# EAGLE design Keypad 0.0 (EAGLE 7.7.0)
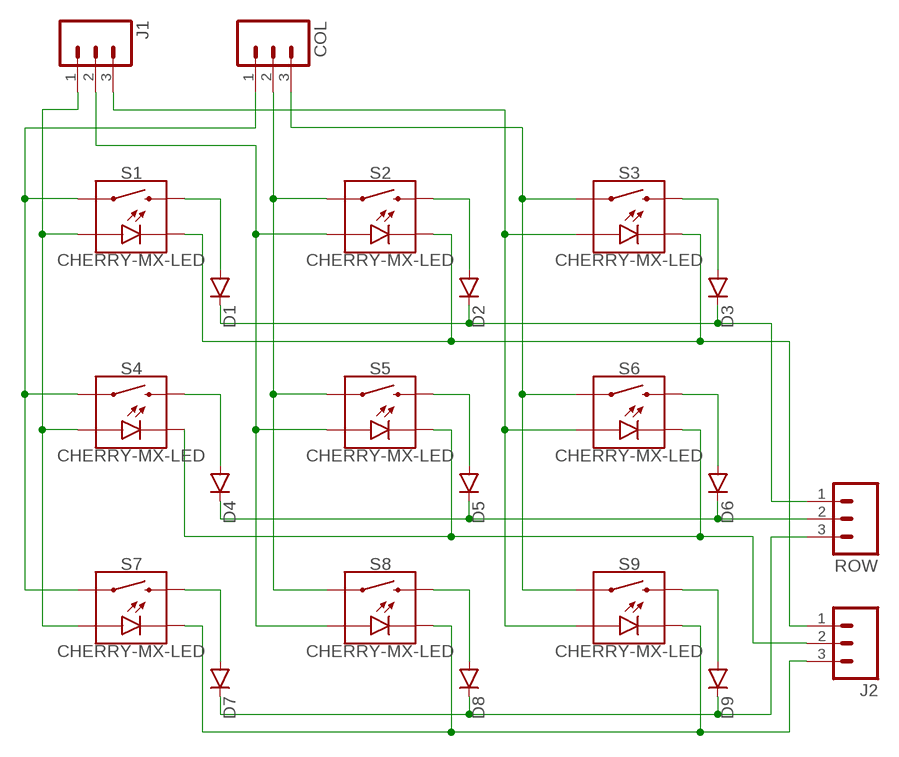
[diagram p0: schematic, sheet 1]

## Parts
COL  M03LOCK  [1X03_LOCK]
D1  DIODESOT23  [SOT23-3]
D2  DIODESOT23  [SOT23-3]
D3  DIODESOT23  [SOT23-3]
D4  DIODESOT23  [SOT23-3]
D5  DIODESOT23  [SOT23-3]
D6  DIODESOT23  [SOT23-3]
D7  DIODESOT23  [SOT23-3]
D8  DIODESOT23  [SOT23-3]
D9  DIODESOT23  [SOT23-3]
J1  M03LOCK  [1X03_LOCK]
J2  M03LOCK  [1X03_LOCK]
ROW  M03LOCK  [1X03_LOCK]
S1  CHERRY-MX-LED  [CHERRY-MX-LED]
S2  CHERRY-MX-LED  [CHERRY-MX-LED]
S3  CHERRY-MX-LED  [CHERRY-MX-LED]
S4  CHERRY-MX-LED  [CHERRY-MX-LED]
S5  CHERRY-MX-LED  [CHERRY-MX-LED]
S6  CHERRY-MX-LED  [CHERRY-MX-LED]
S7  CHERRY-MX-LED  [CHERRY-MX-LED]
S8  CHERRY-MX-LED  [CHERRY-MX-LED]
S9  CHERRY-MX-LED  [CHERRY-MX-LED]

## Nets
N$1: COL.1 S1.S1 S4.S1 S7.S1
N$2: COL.2 S2.S1 S5.S1 S8.S1
N$3: COL.3 S3.S1 S6.S1 S9.S1
N$4: D1.3(C) D2.3(C) D3.3(C) ROW.1
N$5: D4.3(C) D5.3(C) D6.3(C) ROW.2
N$6: D7.3(C) D8.3(C) D9.3(C) ROW.3
N$7: D1.1(A) S1.S2
N$8: D2.1(A) S2.S2
N$9: D3.1(A) S3.S2
N$10: D4.1(A) S4.S2
N$11: D5.1(A) S5.S2
N$12: D6.1(A) S6.S2
N$13: D7.1(A) S7.S2
N$14: D8.1(A) S8.S2
N$15: D9.1(A) S9.S2
N$16: J1.1 S1.A S4.A S7.A
N$17: J1.2 S2.A S5.A S8.A
N$18: J1.3 S3.A S6.A S9.A
N$19: J2.1 S1.K(C) S2.K(C) S3.K(C)
N$20: J2.2 S4.K(C) S5.K(C) S6.K(C)
N$21: J2.3 S7.K(C) S8.K(C) S9.K(C)

## Library data of the parts
COL J1 J2 ROW = SparkFun-Connectors:M03: Header 3 Standard 3-pin 0.1" header. Use with straight break away headers (SKU : PRT-00116), right angle break away headers (PRT-00553), swiss pins (PRT-00743), machine pins (PRT-00117), and female headers (PRT-00115). Molex polarized connector foot print use with SKU : PRT-08232 with associated crimp pins and housings.
D1-D9 = SparkFun-DiscreteSemi:DIODE: Diode These are standard reverse protection diodes and small signal diodes. SMA package can handle up to about 1A. SOD-323 can handle about 200mA. What the SOD-323 package when ordering, there are some mfgs out there that are 5-pin packages.
S1-S9 = SparkFun-Electromechanical:CHERRY-MX-LED: Cherry MX Switch - Electromechanical Swith w/ LED Cherry MX Keyswitches are top-of-the-line mechanical keyboard switches. They’re satisfyingly “clicky”, reliable up to tens-of-millions of key presses, and a standard in gaming and programming keyboards across the globe. This ‘blue’ version Cherry MX Switch is favored by most due to its secondary internal actuator making it less likely to “double-tap.” If you are looking for a noticeably audible and high-quality key switch, this is the perfect option for you! SparkFun Product Link <https://www.sparkfun.com/products/13834>; SF_ID: COM-13834

## Board
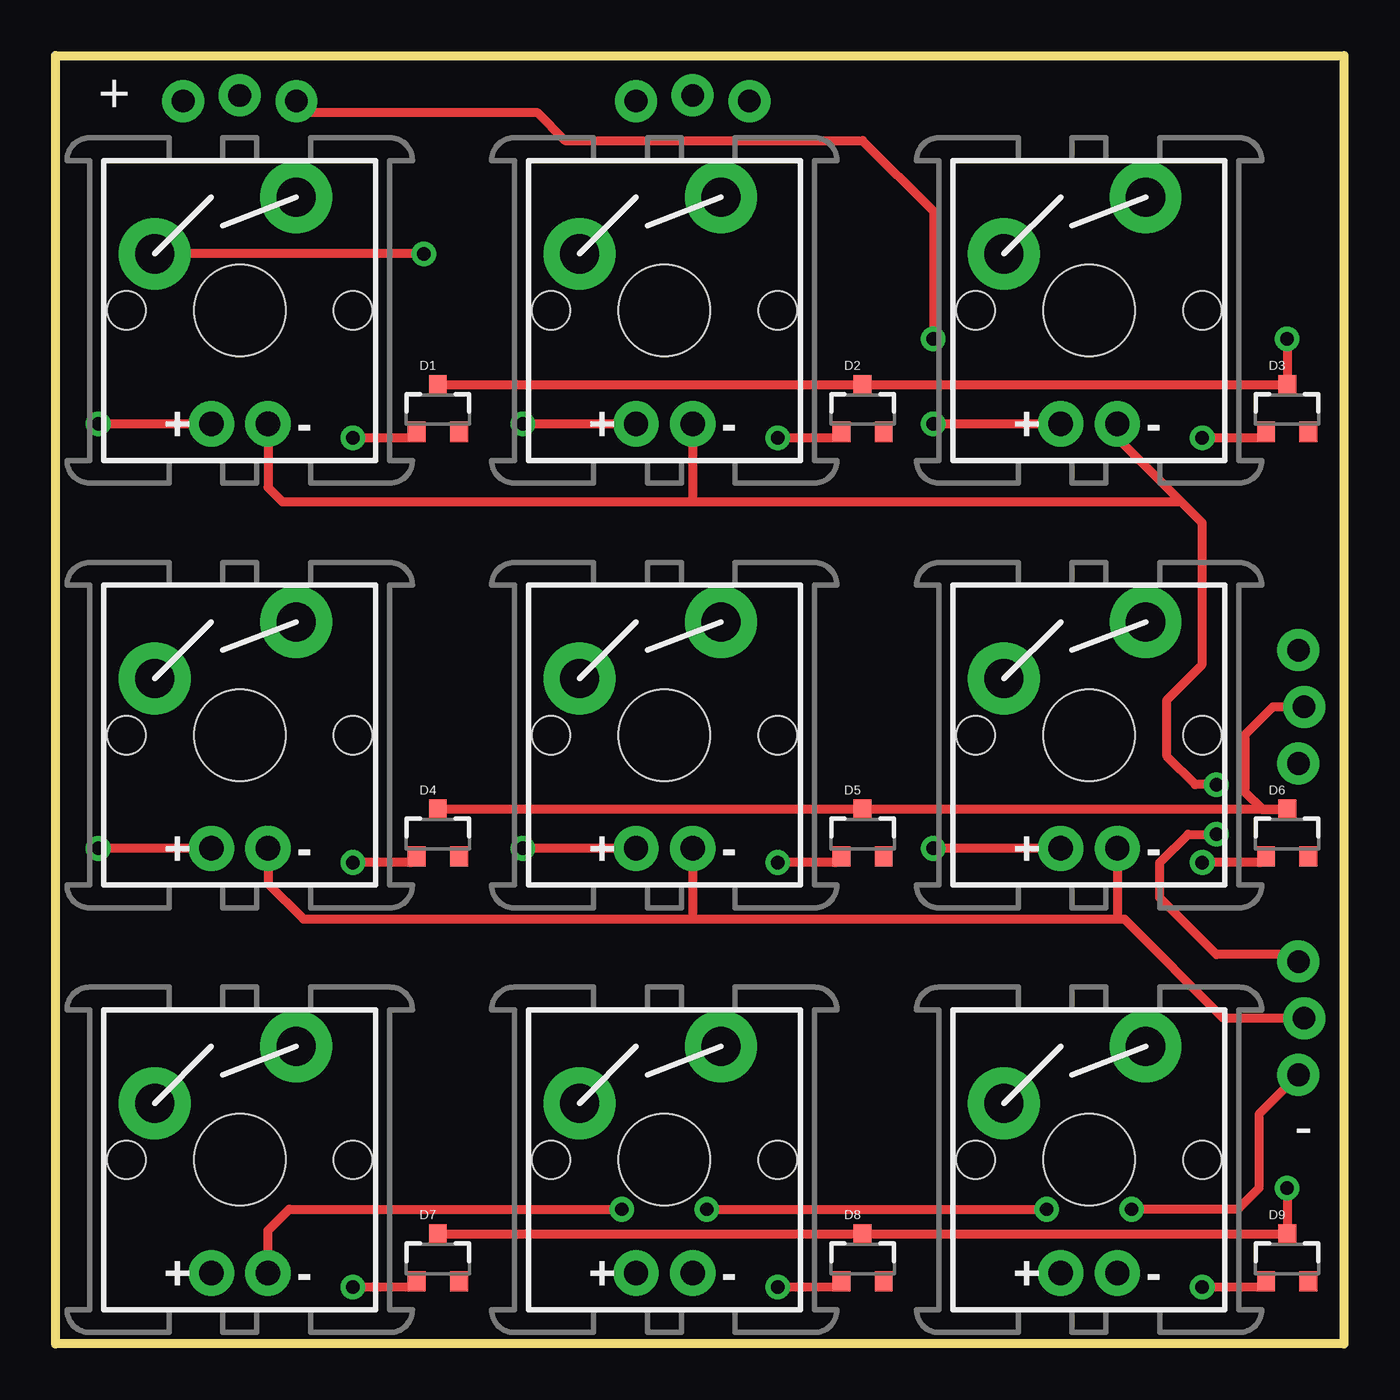
[diagram p1: board, top side]
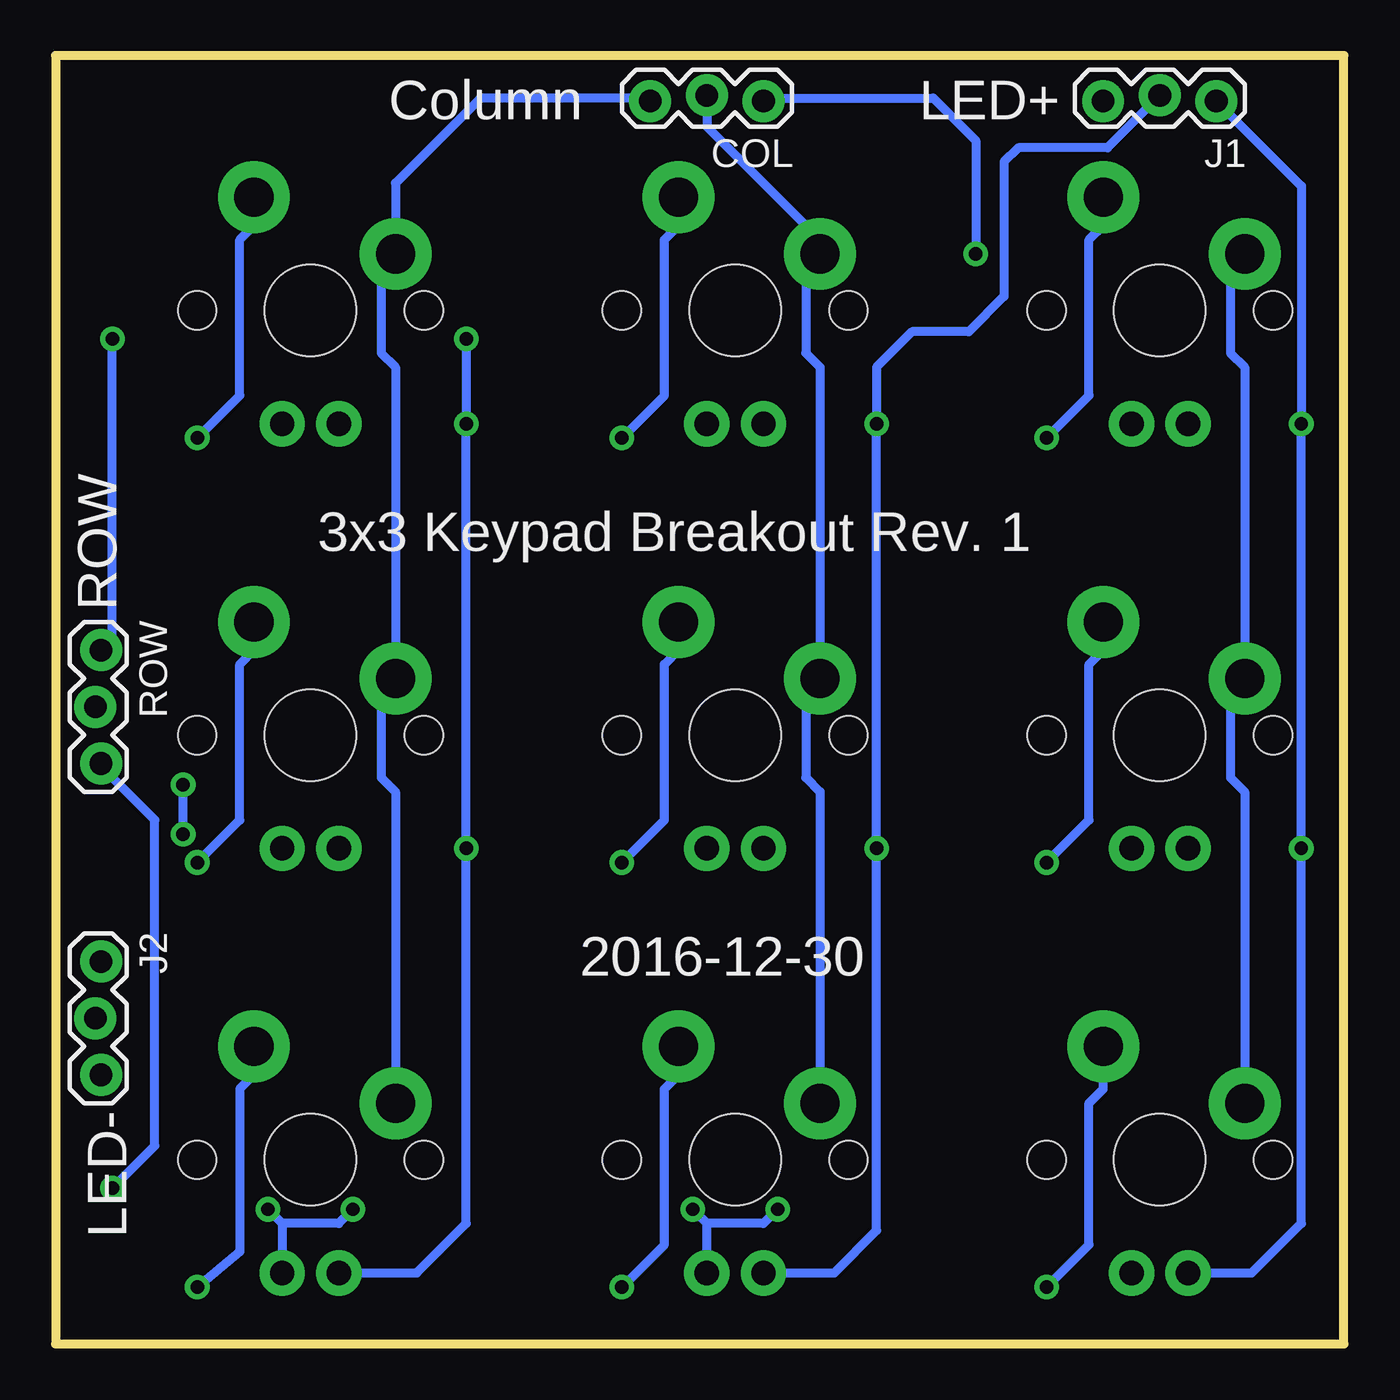
[diagram p2: board, bottom side, seen from below]

Size 57.78 x 57.78 mm. Coordinates in mm from the lower left corner, seen from the top.
Outline: 0,0 0,57.78 57.78,57.78 57.78,0 0,0
Copper layers (1*16): Top 0.035mm / dielectric 1.5mm / Bottom 0.035mm
Design rules "SparkFun": minimum track width 8mil, minimum drill 20mil, track to track 8mil, track to pad 8mil, pad to pad 8mil, via to via 8mil, smd to smd 8mil, copper to edge 8mil, drill to drill 8mil, minimum pad ring 12mil, minimum via ring 10mil, stop-mask expansion 4mil, vias tented up to drill 20mil, thermal gap 10mil

### Footprints (pad centres in the part's own frame; a part is rotated, then mirrored left to right if it is on the bottom)
1X03_LOCK = drill 1.016 pad 1.88: 1 0,0.127; 2 2.54,-0.127; 3 5.08,0.127
SOT23-3 = smd 0.8 x 0.9: 1 -0.95,-1; 2 0.95,-1; 3 0,1.1
CHERRY-MX-LED = drill 1.092 pad 2.032: A -1.27,-5.08; K 1.27,-5.08 | drill 1.753 pad 3.226: S1 -3.81,2.54; S2 2.54,5.08 | hole 4.089: 0,0 | hole 1.707: -5.08,0; 5.08,0

### Placement (x,y rotation side)
COL  26.04,55.88 180 bottom
D1  17.14,41.91 0 top
D2  36.2,41.91 0 top
D3  55.24,41.91 0 top
D4  17.14,22.86 0 top
D5  36.2,22.86 0 top
D6  55.24,22.86 0 top
D7  17.14,3.81 0 top
D8  36.2,3.81 0 top
D9  55.24,3.81 0 top
J1  5.71,55.88 180 bottom
J2  55.88,17.14 270 bottom
ROW  55.88,31.11 270 bottom
S1  8.26,46.35 0 top
S2  27.3,46.35 0 top
S3  46.35,46.35 0 top
S4  8.26,27.3 0 top
S5  27.3,27.3 0 top
S6  46.35,27.3 0 top
S7  8.26,8.26 0 top
S8  27.3,8.26 0 top
S9  46.35,8.26 0 top

### Tracks (layer width: path | path; a pad name or v marks a point on that pad's centre or on a via)
N$1  (via drill 0.6)
  Top 0.406: v16.51,48.9 S1.S1
  Bottom 0.406: S1.S1 5.08,48.26 5.08,44.45 4.45,43.81 S4.S1 5.08,29.21 5.08,25.4 4.45,24.77 S7.S1 | COL.1 25.91,55.88 18.41,55.88 16.51,53.98 v16.51,48.9
N$2
  Bottom 0.406: COL.2 28.57,54.61 23.5,49.53 S2.S1 24.13,48.26 24.13,44.45 23.5,43.81 S5.S1 24.13,29.21 24.13,25.4 23.5,24.77 S8.S1
N$3
  Bottom 0.406: COL.3 31.24,55.88 38.73,55.88 42.55,52.07 S3.S1 43.18,48.26 43.18,44.45 42.55,43.81 S6.S1 43.18,29.21 43.18,25.4 42.55,24.77 S9.S1
N$4  (via drill 0.6)
  Top 0.406: v55.24,45.09 D3.3 D2.3 D1.3
  Bottom 0.406: ROW.1 55.24,31.62 v55.24,45.09
N$5
  Top 0.406: ROW.2 54.61,28.57 53.34,27.3 53.34,24.77 54.15,23.96 D6.3 D5.3 D4.3
N$6  (via drill 0.6)
  Top 0.406: v55.24,6.99 D9.3 D8.3 D7.3
  Bottom 0.406: ROW.3 55.24,25.53 55.24,25.4 53.34,23.5 53.34,8.89 v55.24,6.99
N$7  (via drill 0.6)
  Top 0.406: D1.1 15.93,40.64 v13.34,40.64
  Bottom 0.406: v13.34,40.64 11.43,42.55 11.43,49.53 10.79,50.16 S1.S2
N$8  (via drill 0.6)
  Top 0.406: D2.1 34.98,40.64 v32.38,40.64
  Bottom 0.406: v32.38,40.64 30.48,42.55 30.48,49.53 29.84,50.16 S2.S2
N$9  (via drill 0.6)
  Top 0.406: D3.1 54.02,40.64 v51.44,40.64
  Bottom 0.406: v51.44,40.64 49.53,42.55 49.53,49.53 48.9,50.16 S3.S2
N$10  (via drill 0.6)
  Top 0.406: D4.1 15.93,21.59 v13.34,21.59
  Bottom 0.406: v13.34,21.59 11.43,23.5 11.43,30.48 10.79,31.11 S4.S2
N$11  (via drill 0.6)
  Top 0.406: D5.1 34.98,21.59 v32.38,21.59
  Bottom 0.406: v32.38,21.59 30.48,23.5 30.48,30.48 29.84,31.11 S5.S2
N$12  (via drill 0.6)
  Top 0.406: D6.1 54.02,21.59 v51.44,21.59
  Bottom 0.406: v51.44,21.59 49.53,23.5 49.53,30.48 48.9,31.11 S6.S2
N$13  (via drill 0.6)
  Top 0.406: D7.1 15.93,2.54 v13.34,2.54
  Bottom 0.406: v13.34,2.54 11.43,4.45 11.43,10.79 10.79,11.43 S7.S2
N$14  (via drill 0.6)
  Top 0.406: D8.1 34.98,2.54 v32.38,2.54
  Bottom 0.406: v32.38,2.54 30.48,4.45 30.48,11.43 29.84,12.06 S8.S2
N$15  (via drill 0.6)
  Top 0.406: D9.1 54.02,2.54 v51.44,2.54
  Bottom 0.406: S9.S2 48.9,12.06 49.53,11.43 49.53,4.13 v51.44,2.54
N$16  (via drill 0.6)
  Top 0.406: v1.91,41.27 S1.A | S4.A v1.91,22.23
  Bottom 0.406: J1.1 1.91,51.94 v1.91,41.27 v1.91,22.23 1.91,5.4 4.13,3.17 S7.A
N$17  (via drill 0.6)
  Top 0.406: v20.95,41.27 S2.A | S5.A v20.95,22.23
  Bottom 0.406: J1.2 10.6,53.66 14.61,53.66 15.24,53.02 15.24,46.99 16.83,45.4 19.37,45.4 20.95,43.81 v20.95,41.27 v20.95,22.23 20.95,5.08 22.86,3.17 S8.A
N$18  (via drill 0.6)
  Top 0.406: J1.3 11.3,55.24 21.59,55.24 22.86,53.98 36.2,53.98 39.37,50.8 v39.37,45.09 | v39.37,41.27 S3.A | S6.A v39.37,22.23
  Bottom 0.406: v39.37,45.09 v39.37,41.27 v39.37,22.23 39.37,5.4 41.59,3.17 S9.A
N$19  (via drill 0.6)
  Top 0.406: J2.1 55.44,17.46 52.07,17.46 49.53,20 49.53,21.59 50.8,22.86 v52.07,22.86 | 50.48,37.78 51.44,36.83 51.44,30.48 49.85,28.89 49.85,26.35 51.12,25.08 v52.07,25.08 | 50.48,37.78 47.62,40.64 S3.K | S2.K 28.57,37.78 | 28.57,37.78 50.48,37.78 | S1.K 9.53,38.42 10.16,37.78 28.57,37.78
  Bottom 0.406: v52.07,22.86 v52.07,25.08
N$20
  Top 0.406: J2.2 52.39,14.61 47.94,19.05 47.62,19.05 | 28.57,19.05 11.11,19.05 9.53,20.64 S4.K | 28.57,19.05 47.62,19.05 | S6.K 47.62,19.05 | S5.K 28.57,19.05
N$21  (via drill 0.6)
  Top 0.406: J2.3 53.98,10.29 53.98,6.99 53.02,6.03 v48.26,6.03 | v29.21,6.03 v44.45,6.03 | v25.4,6.03 10.48,6.03 9.53,5.08 S7.K
  Bottom 0.406: v48.26,6.03 47.62,5.4 | 47.62,5.4 S9.K | v44.45,6.03 45.09,5.4 47.62,5.4 | v25.4,6.03 26.04,5.4 28.57,5.4 | 28.57,5.4 v29.21,6.03 | S8.K 28.57,5.4

### Text on the board
tPlace: + | -
bPlace: LED+ | Column | ROW | 3x3 Keypad Breakout Rev. 1 | 2016-12-30 | LED-